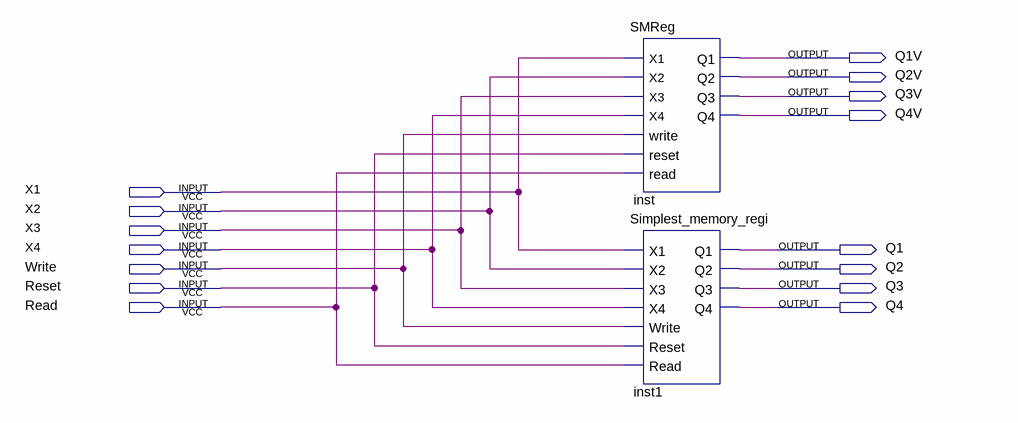
[diagram p0: schematic sheet]
// Quartus schematic 915.bdf as structural Verilog: 2 symbols, 15 pins
module \915  (
  input  X1,
  input  X2,
  input  X3,
  input  X4,
  input  Write,
  input  Reset,
  input  Read,
  output Q1V,
  output Q2V,
  output Q3V,
  output Q4V,
  output Q1,
  output Q2,
  output Q3,
  output Q4
);

  SMReg inst (
    .X1(X1), .X2(X2), .X3(X3), .X4(X4), .write(Write), .reset(Reset), .read(Read), .Q1(Q1V), .Q2(Q2V),
    .Q3(Q3V), .Q4(Q4V));
  Simplest_memory_regi inst1 (
    .X1(X1), .X2(X2), .X3(X3), .X4(X4), .Write(Write), .Reset(Reset), .Read(Read), .Q1(Q1), .Q2(Q2), .Q3(Q3),
    .Q4(Q4));
endmodule
